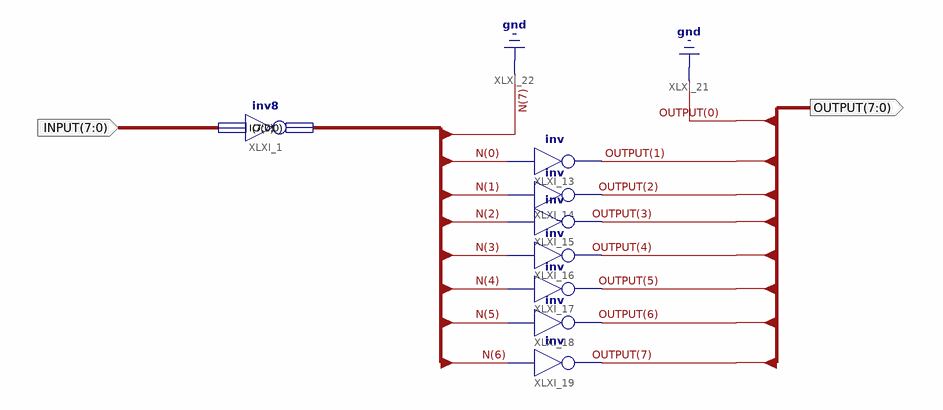
[diagram p0: schematic sheet 1]
// Xilinx ISE schematic SHL.sch (spartan6) as structural Verilog: 8 symbols, 2 ports
module SHL (
  input  [7:0] INPUT,
  output [7:0] OUTPUT
);

  wire [7:0] N;

  inv8 XLXI_1 (.I(INPUT), .O(N));
  not XLXI_13 (OUTPUT[1], N[0]);
  not XLXI_14 (OUTPUT[2], N[1]);
  not XLXI_15 (OUTPUT[3], N[2]);
  not XLXI_16 (OUTPUT[4], N[3]);
  not XLXI_17 (OUTPUT[5], N[4]);
  not XLXI_18 (OUTPUT[6], N[5]);
  not XLXI_19 (OUTPUT[7], N[6]);

  assign OUTPUT[0] = 1'b0;
  // also tied to GND on the sheet: N[7]
endmodule
